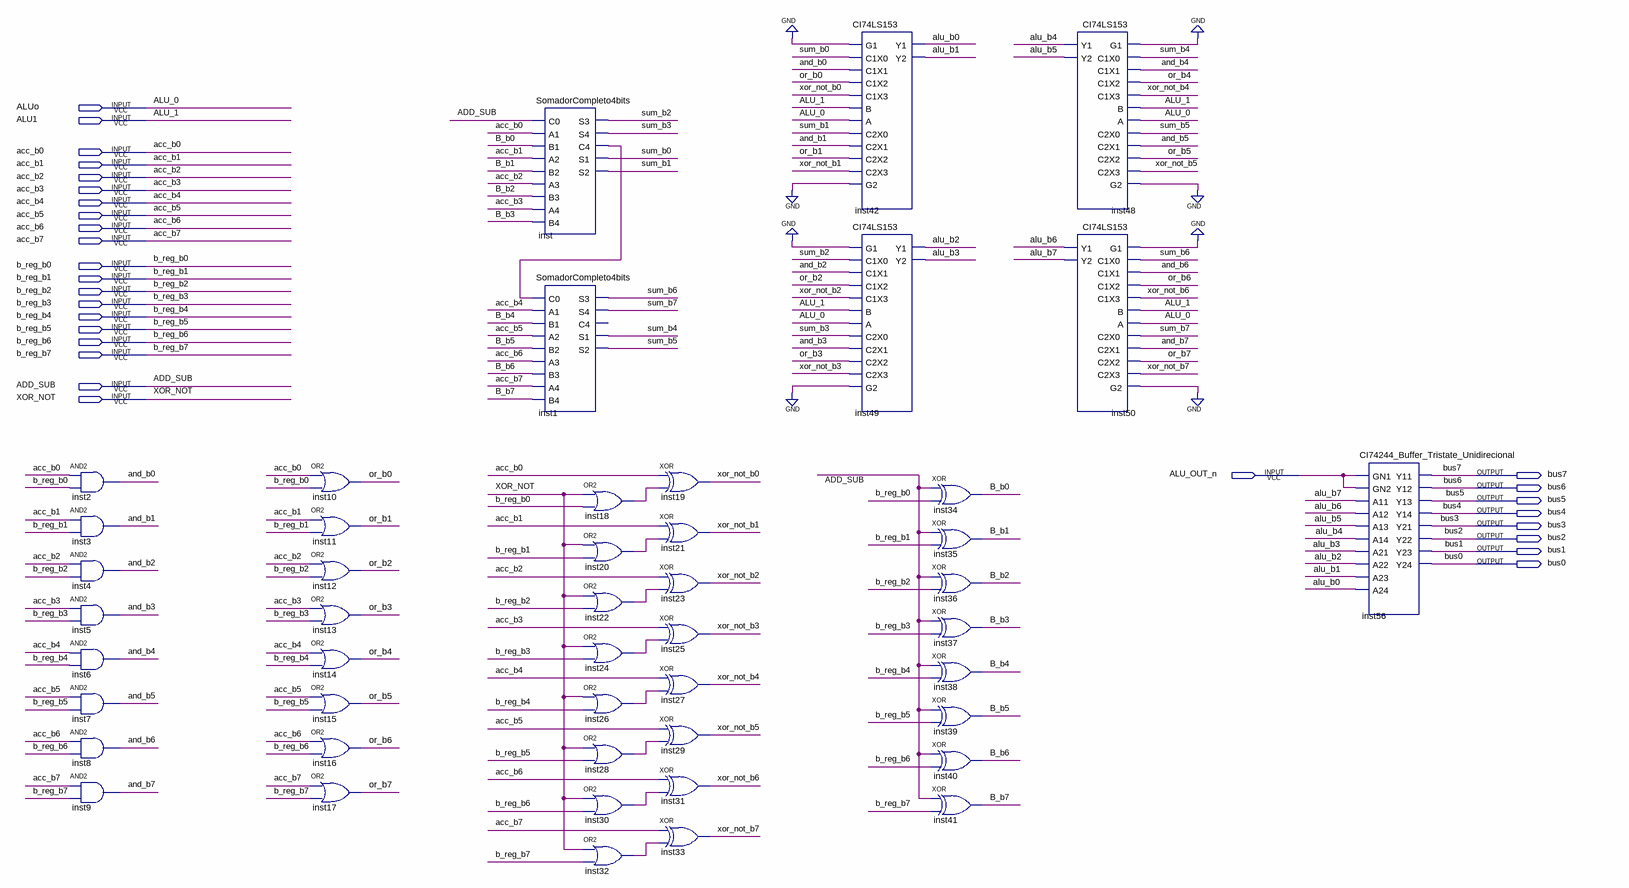
[diagram p0: schematic sheet]
// Quartus schematic ULA.bdf as structural Verilog: 47 symbols, 29 pins
module ULA (
  input  ALUo,
  input  ALU1,
  input  acc_b0,
  input  acc_b1,
  input  acc_b2,
  input  acc_b3,
  input  acc_b4,
  input  acc_b5,
  input  acc_b6,
  input  acc_b7,
  input  b_reg_b0,
  input  b_reg_b1,
  input  b_reg_b2,
  input  b_reg_b3,
  input  b_reg_b4,
  input  b_reg_b5,
  input  b_reg_b6,
  input  b_reg_b7,
  input  ADD_SUB,
  input  XOR_NOT,
  input  ALU_OUT_n,
  output bus7,
  output bus6,
  output bus5,
  output bus4,
  output bus3,
  output bus2,
  output bus1,
  output bus0
);

  wire alu_b0, alu_b1, alu_b2, alu_b3, alu_b4, alu_b5, alu_b6, alu_b7, and_b0, and_b1, and_b2, and_b3,
       and_b4, and_b5, and_b6, and_b7, B_b0, B_b1, B_b2, B_b3, B_b4, B_b5, B_b6, B_b7, inst18_out,
       inst20_out, inst22_out, inst24_out, inst26_out, inst28_out, inst30_out, inst32_out, inst_c4, or_b0,
       or_b1, or_b2, or_b3, or_b4, or_b5, or_b6, or_b7, sum_b0, sum_b1, sum_b2, sum_b3, sum_b4, sum_b5,
       sum_b6, sum_b7, xor_not_b0, xor_not_b1, xor_not_b2, xor_not_b3, xor_not_b4, xor_not_b5, xor_not_b6,
       xor_not_b7;

  and inst2 (and_b0, acc_b0, b_reg_b0);
  and inst3 (and_b1, acc_b1, b_reg_b1);
  and inst4 (and_b2, acc_b2, b_reg_b2);
  and inst5 (and_b3, acc_b3, b_reg_b3);
  and inst6 (and_b4, acc_b4, b_reg_b4);
  and inst7 (and_b5, acc_b5, b_reg_b5);
  and inst8 (and_b6, acc_b6, b_reg_b6);
  and inst9 (and_b7, acc_b7, b_reg_b7);
  or inst10 (or_b0, acc_b0, b_reg_b0);
  or inst11 (or_b1, acc_b1, b_reg_b1);
  or inst12 (or_b2, acc_b2, b_reg_b2);
  or inst13 (or_b3, acc_b3, b_reg_b3);
  or inst14 (or_b4, acc_b4, b_reg_b4);
  or inst15 (or_b5, acc_b5, b_reg_b5);
  or inst16 (or_b6, acc_b6, b_reg_b6);
  or inst17 (or_b7, acc_b7, b_reg_b7);
  SomadorCompleto4bits inst (
    .C0(ADD_SUB), .A1(acc_b0), .B1(B_b0), .A2(acc_b1), .B2(B_b1), .A3(acc_b2), .B3(B_b2), .A4(acc_b3),
    .B4(B_b3), .S3(sum_b2), .S4(sum_b3), .C4(inst_c4), .S1(sum_b0), .S2(sum_b1));
  SomadorCompleto4bits inst1 (
    .C0(inst_c4), .A1(acc_b4), .B1(B_b4), .A2(acc_b5), .B2(B_b5), .A3(acc_b6), .B3(B_b6), .A4(acc_b7),
    .B4(B_b7), .S3(sum_b6), .S4(sum_b7), .S1(sum_b4), .S2(sum_b5));  // open: C4
  or inst18 (inst18_out, XOR_NOT, b_reg_b0);
  or inst20 (inst20_out, XOR_NOT, b_reg_b1);
  or inst22 (inst22_out, XOR_NOT, b_reg_b2);
  or inst24 (inst24_out, XOR_NOT, b_reg_b3);
  or inst26 (inst26_out, XOR_NOT, b_reg_b4);
  or inst28 (inst28_out, XOR_NOT, b_reg_b5);
  or inst30 (inst30_out, XOR_NOT, b_reg_b6);
  or inst32 (inst32_out, XOR_NOT, b_reg_b7);
  xor inst19 (xor_not_b0, acc_b0, inst18_out);
  xor inst21 (xor_not_b1, acc_b1, inst20_out);
  xor inst23 (xor_not_b2, acc_b2, inst22_out);
  xor inst25 (xor_not_b3, acc_b3, inst24_out);
  xor inst27 (xor_not_b4, acc_b4, inst26_out);
  xor inst29 (xor_not_b5, acc_b5, inst28_out);
  xor inst31 (xor_not_b6, acc_b6, inst30_out);
  xor inst33 (xor_not_b7, acc_b7, inst32_out);
  CI74LS153 inst42 (
    .G1(1'b0), .C1X0(sum_b0), .C1X1(and_b0), .C1X2(or_b0), .C1X3(xor_not_b0), .B(ALU1), .A(ALUo),
    .C2X0(sum_b1), .C2X1(and_b1), .C2X2(or_b1), .C2X3(xor_not_b1), .G2(1'b0), .Y1(alu_b0), .Y2(alu_b1));
  CI74LS153 inst49 (
    .G1(1'b0), .C1X0(sum_b2), .C1X1(and_b2), .C1X2(or_b2), .C1X3(xor_not_b2), .B(ALU1), .A(ALUo),
    .C2X0(sum_b3), .C2X1(and_b3), .C2X2(or_b3), .C2X3(xor_not_b3), .G2(1'b0), .Y1(alu_b2), .Y2(alu_b3));
  xor inst34 (B_b0, ADD_SUB, b_reg_b0);
  xor inst35 (B_b1, ADD_SUB, b_reg_b1);
  xor inst36 (B_b2, ADD_SUB, b_reg_b2);
  xor inst37 (B_b3, ADD_SUB, b_reg_b3);
  xor inst38 (B_b4, ADD_SUB, b_reg_b4);
  xor inst39 (B_b5, ADD_SUB, b_reg_b5);
  xor inst40 (B_b6, ADD_SUB, b_reg_b6);
  xor inst41 (B_b7, ADD_SUB, b_reg_b7);
  CI74LS153 inst48 (
    .G1(1'b0), .C1X0(sum_b4), .C1X1(and_b4), .C1X2(or_b4), .C1X3(xor_not_b4), .B(ALU1), .A(ALUo),
    .C2X0(sum_b5), .C2X1(and_b5), .C2X2(or_b5), .C2X3(xor_not_b5), .G2(1'b0), .Y1(alu_b4), .Y2(alu_b5));
  CI74LS153 inst50 (
    .G1(1'b0), .C1X0(sum_b6), .C1X1(and_b6), .C1X2(or_b6), .C1X3(xor_not_b6), .B(ALU1), .A(ALUo),
    .C2X0(sum_b7), .C2X1(and_b7), .C2X2(or_b7), .C2X3(xor_not_b7), .G2(1'b0), .Y1(alu_b6), .Y2(alu_b7));
  CI74244_Buffer_Tristate_Unidirecional inst56 (
    .GN1(ALU_OUT_n), .GN2(ALU_OUT_n), .A11(alu_b7), .A21(alu_b3), .A12(alu_b6), .A22(alu_b2), .A13(alu_b5),
    .A23(alu_b1), .A14(alu_b4), .A24(alu_b0), .Y11(bus7), .Y21(bus3), .Y12(bus6), .Y22(bus2), .Y13(bus5),
    .Y23(bus1), .Y14(bus4), .Y24(bus0));

  // Other names for the same wires on the sheet: ALU_0 = ALUo; ALU_1 = ALU1
endmodule
